# Altium schematic sheet power.SCHDOC
size A
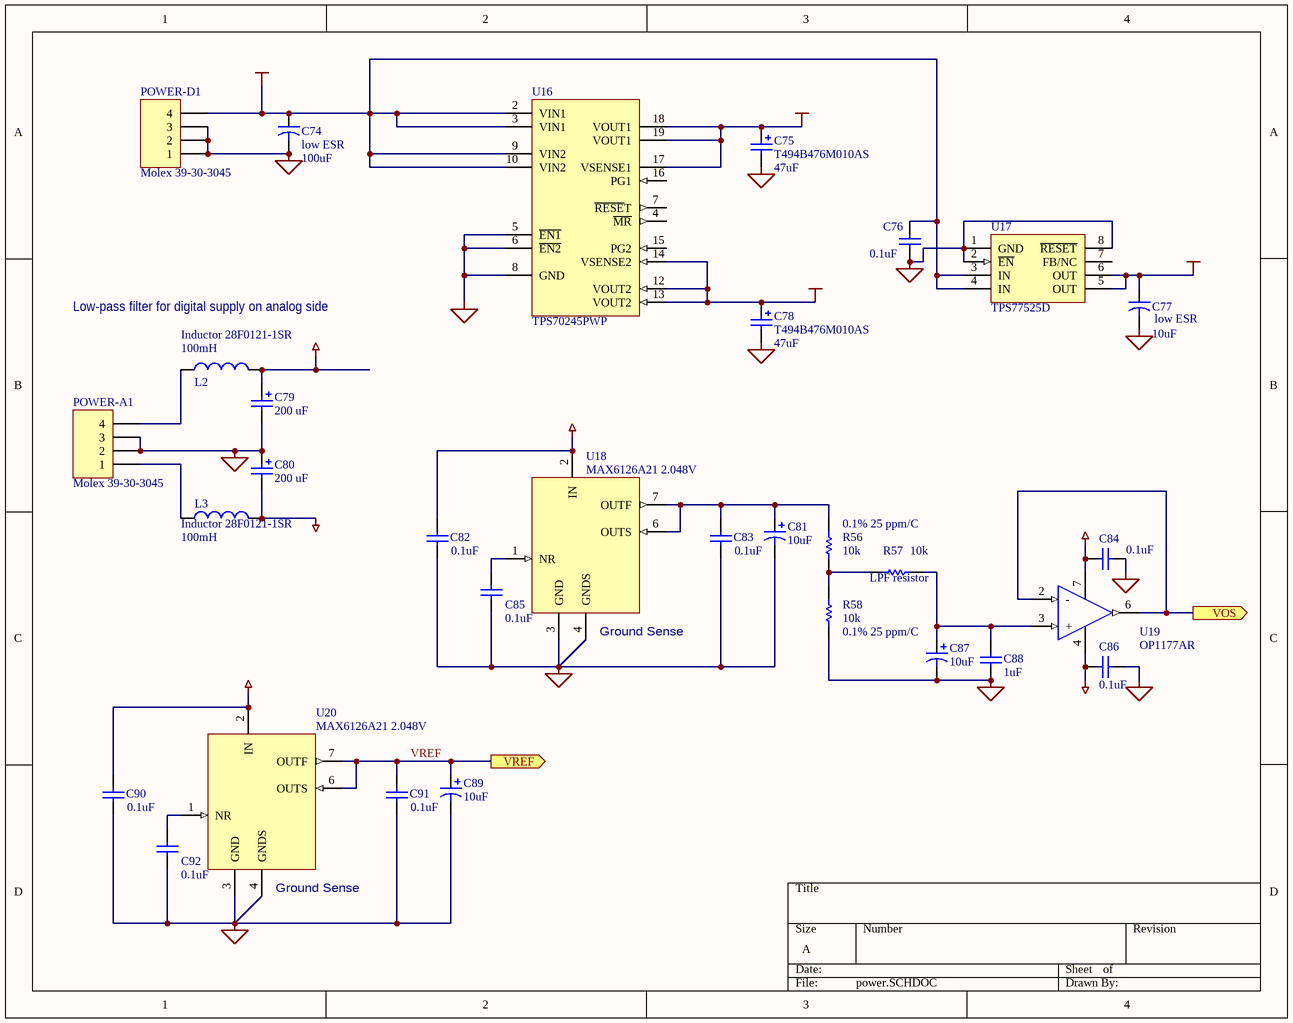
[diagram p0: power.SCHDOC]

## Parts
C74  low ESR  value 100uF  [PanasonicE]
C75  T494B476M010AS  value 47uF  [TC3528-1411]
C76  value 0.1uF  [CC1608-0603]  (hidden comment: Cap)
C77  low ESR  value 10uF  [TC3528-1411]
C78  T494B476M010AS  value 47uF  [TC3528-1411]
C79  value 200 uF  [PanasonicE]
C80  value 200 uF  [PanasonicE]
C81  value 10uF  [TC3528-1411]  (hidden comment: Cap Pol1)
C82  value 0.1uF  [CC1608-0603]  (hidden comment: Cap)
C83  value 0.1uF  [CC1608-0603]  (hidden comment: Cap)
C84  value 0.1uF  [CC1608-0603]  (hidden comment: Cap)
C85  value 0.1uF  [CC1608-0603]  (hidden comment: Cap)
C86  value 0.1uF  [CC1608-0603]  (hidden comment: Cap)
C87  value 10uF  [TC3528-1411]  (hidden comment: Cap Pol1)
C88  value 1uF  [CC1608-0603]  (hidden comment: Cap)
C89  value 10uF  [TC3528-1411]  (hidden comment: Cap Pol1)
C90  value 0.1uF  [CC1608-0603]  (hidden comment: Cap)
C91  value 0.1uF  [CC1608-0603]  (hidden comment: Cap)
C92  value 0.1uF  [CC1608-0603]  (hidden comment: Cap)
L2  Inductor 28F0121-1SR  value 100mH  [STEWARD_1SR]
L3  Inductor 28F0121-1SR  value 100mH  [STEWARD_1SR]
POWER-A1  Molex 39-30-3045  [MJ4RTHR]
POWER-D1  Molex 39-30-3045  [MJ4RTHR]
R56  0.1% 25 ppm/C  value 10k  [CC1608-0603]
R57  LPF resistor  value 10k  [CC1608-0603]
R58  0.1% 25 ppm/C  value 10k  [CC1608-0603]
U16  TPS70245PWP  [PWP PowerPad -20]
U17  TPS77525D  [SO-G8]
U18  MAX6126A21 2.048V  [TSSO3x5-G8/X.35]
U19  OP1177AR  [TSSO3X5-G8/X.4]
U20  MAX6126A21 2.048V  [TSSO3x5-G8/X.35]

## Ports
VOS (out), VREF (out)

## Nets
+1.2VCC: C78.1 U16.12(VOUT2) U16.13(VOUT2) U16.14(VSENSE2)
+2.5VCC: C77.1 U17.5(OUT) U17.6(OUT)
+5VCC: C74.1 C76.1 POWER-D1.4 U16.2(VIN1) U16.3(VIN1) U16.9(VIN2) U16.10(VIN2) U17.3(IN) U17.4(IN)
AGND: C79.2 C80.1 C81.2 C82.2 C83.2 C84.1 C85.2 C86.1 C87.2 C88.2 C89.2 C90.2 C91.2 C92.2 POWER-A1.2 POWER-A1.3 R58.1 U18.3(GND) U18.4(GNDS) U20.3(GND) U20.4(GNDS)
AVDD: C79.1 C82.1 C84.2 C90.1 L2.2 U18.2(IN) U19.7(+Vs) U20.2(IN)
AVSS: C80.2 C86.2 L3.2 U19.4(-Vs)
GND: C74.2 C75.2 C76.2 C77.2 C78.2 POWER-D1.1 POWER-D1.2 POWER-D1.3 U16.5(~{EN1}) U16.6(~{EN2}) U16.8(GND) U16.P1 U16.P2 U16.P3 U16.P4 U16.P5 U16.P6 U16.P7 U16.P8 U16.P9 U16.P10 U16.P11 U16.P12 U16.P13 U16.P14 U16.P15 U16.P16 U16.P17 U17.1(GND) U17.2(~{EN}) U17.8(~{RESET})
VCC: C75.1 U16.17(VSENSE1) U16.18(VOUT1) U16.19(VOUT1)
VOS: U19.2(-) U19.6(Out) ; port VOS
VREF: C89.1 C91.1 U20.6(OUTS) U20.7(OUTF) ; port VREF
NetC81_1: C81.1 C83.1 R56.2 U18.6(OUTS) U18.7(OUTF)
NetC85_1: C85.1 U18.1(NR)
NetC87_1: C87.1 C88.1 R57.1 U19.3(+)
NetC92_1: C92.1 U20.1(NR)
NetL2_1: L2.1 POWER-A1.4
NetL3_1: L3.1 POWER-A1.1
NetR56_1: R56.1 R57.2 R58.2

Not connected (* = marked no-connect by the designer): U16 4(~{MR}) 7(~{RESE}T) 15(PG2) 16(PG1); U17 7(FB/NC)

## Notes on the sheet
- Low-pass filter for digital supply on analog side
- (near U18) Ground Sense
- (near U20) Ground Sense

## Library data of the parts
C74 C77 = Cap2: Capacitor; Manufacturer: Generic Components; Class I: Passive; Published: 23-Sep-2002; Publisher: Altium Limited; Class II: Capacitor
C75 C78 = Cap Pol1: Polarized Capacitor (Radial); Manufacturer: Generic Components; Class I: Passive; Published: 8-Jun-2000; Revision: July-2002: Re-released for DXP Platform.; Publisher: Altium Limited; Class II: Capacitor
C76 C82-C86 C88 C90-C92 = Cap: Capacitor; Manufacturer: Generic Components; Class I: Passive; Published: 8-Jun-2000; Revision: July-2002: Re-released for DXP Platform.; Publisher: Altium Limited; Class II: Capacitor
C79 C80 = Cap Pol3: Polarized Capacitor (Surface Mount); Manufacturer: Generic Components; Class I: Passive; Published: 8-Jun-2000; Revision: July-2002: Re-released for DXP Platform.; Publisher: Altium Limited; Class II: Capacitor
C81 C87 C89 = Cap Pol1: Polarized Capacitor (Radial); Published: 8-Jun-2000; LatestRevisionDate: 17-Jul-2002; LatestRevisionNote: Re-released for DXP Platform.; Publisher: Altium Limited
L2 L3 = Inductor: Manufacturer: Generic Components; Class I: Passive; Published: 8-Jun-2000; Revision: July-2002: Re-released for DXP Platform.; Publisher: Altium Limited; Class II: Inductor
POWER-A1 POWER-D1 = Header 4: Header, 4-Pin; Manufacturer: Generic Components; Class I: Connector; Revision: July-2002: Re-released for DXP Platform.; Publisher: Altium Limited
R56-R58 = Res1: Resistor; Manufacturer: Generic Components; Class I: Passive; Published: 8-Jun-2000; Revision: July-2002: Re-released for DXP Platform.; Publisher: Altium Limited; Class II: Resistor
U16 = TPS70245PWP: TI dual-output low dropout voltage regulators; Vendor: Texas Instruments
U17 = TPS77525D: Fast-transient-response 500 mA low-dropout voltage regulator; Vendor: Texas Instruments
U18 U20 = MAX6126A21: Ultra-High-Precision, Ultra-Low-Noise, Series Voltage Reference; Vendor: Maxim Integrated Products
U19 = OP1177: Precision Low Noise, Low Input Bias Current Operational Amplifier; Vendor: Analog Devices